# EAGLE design m2_feather_interposer (EAGLE 9.6.2)
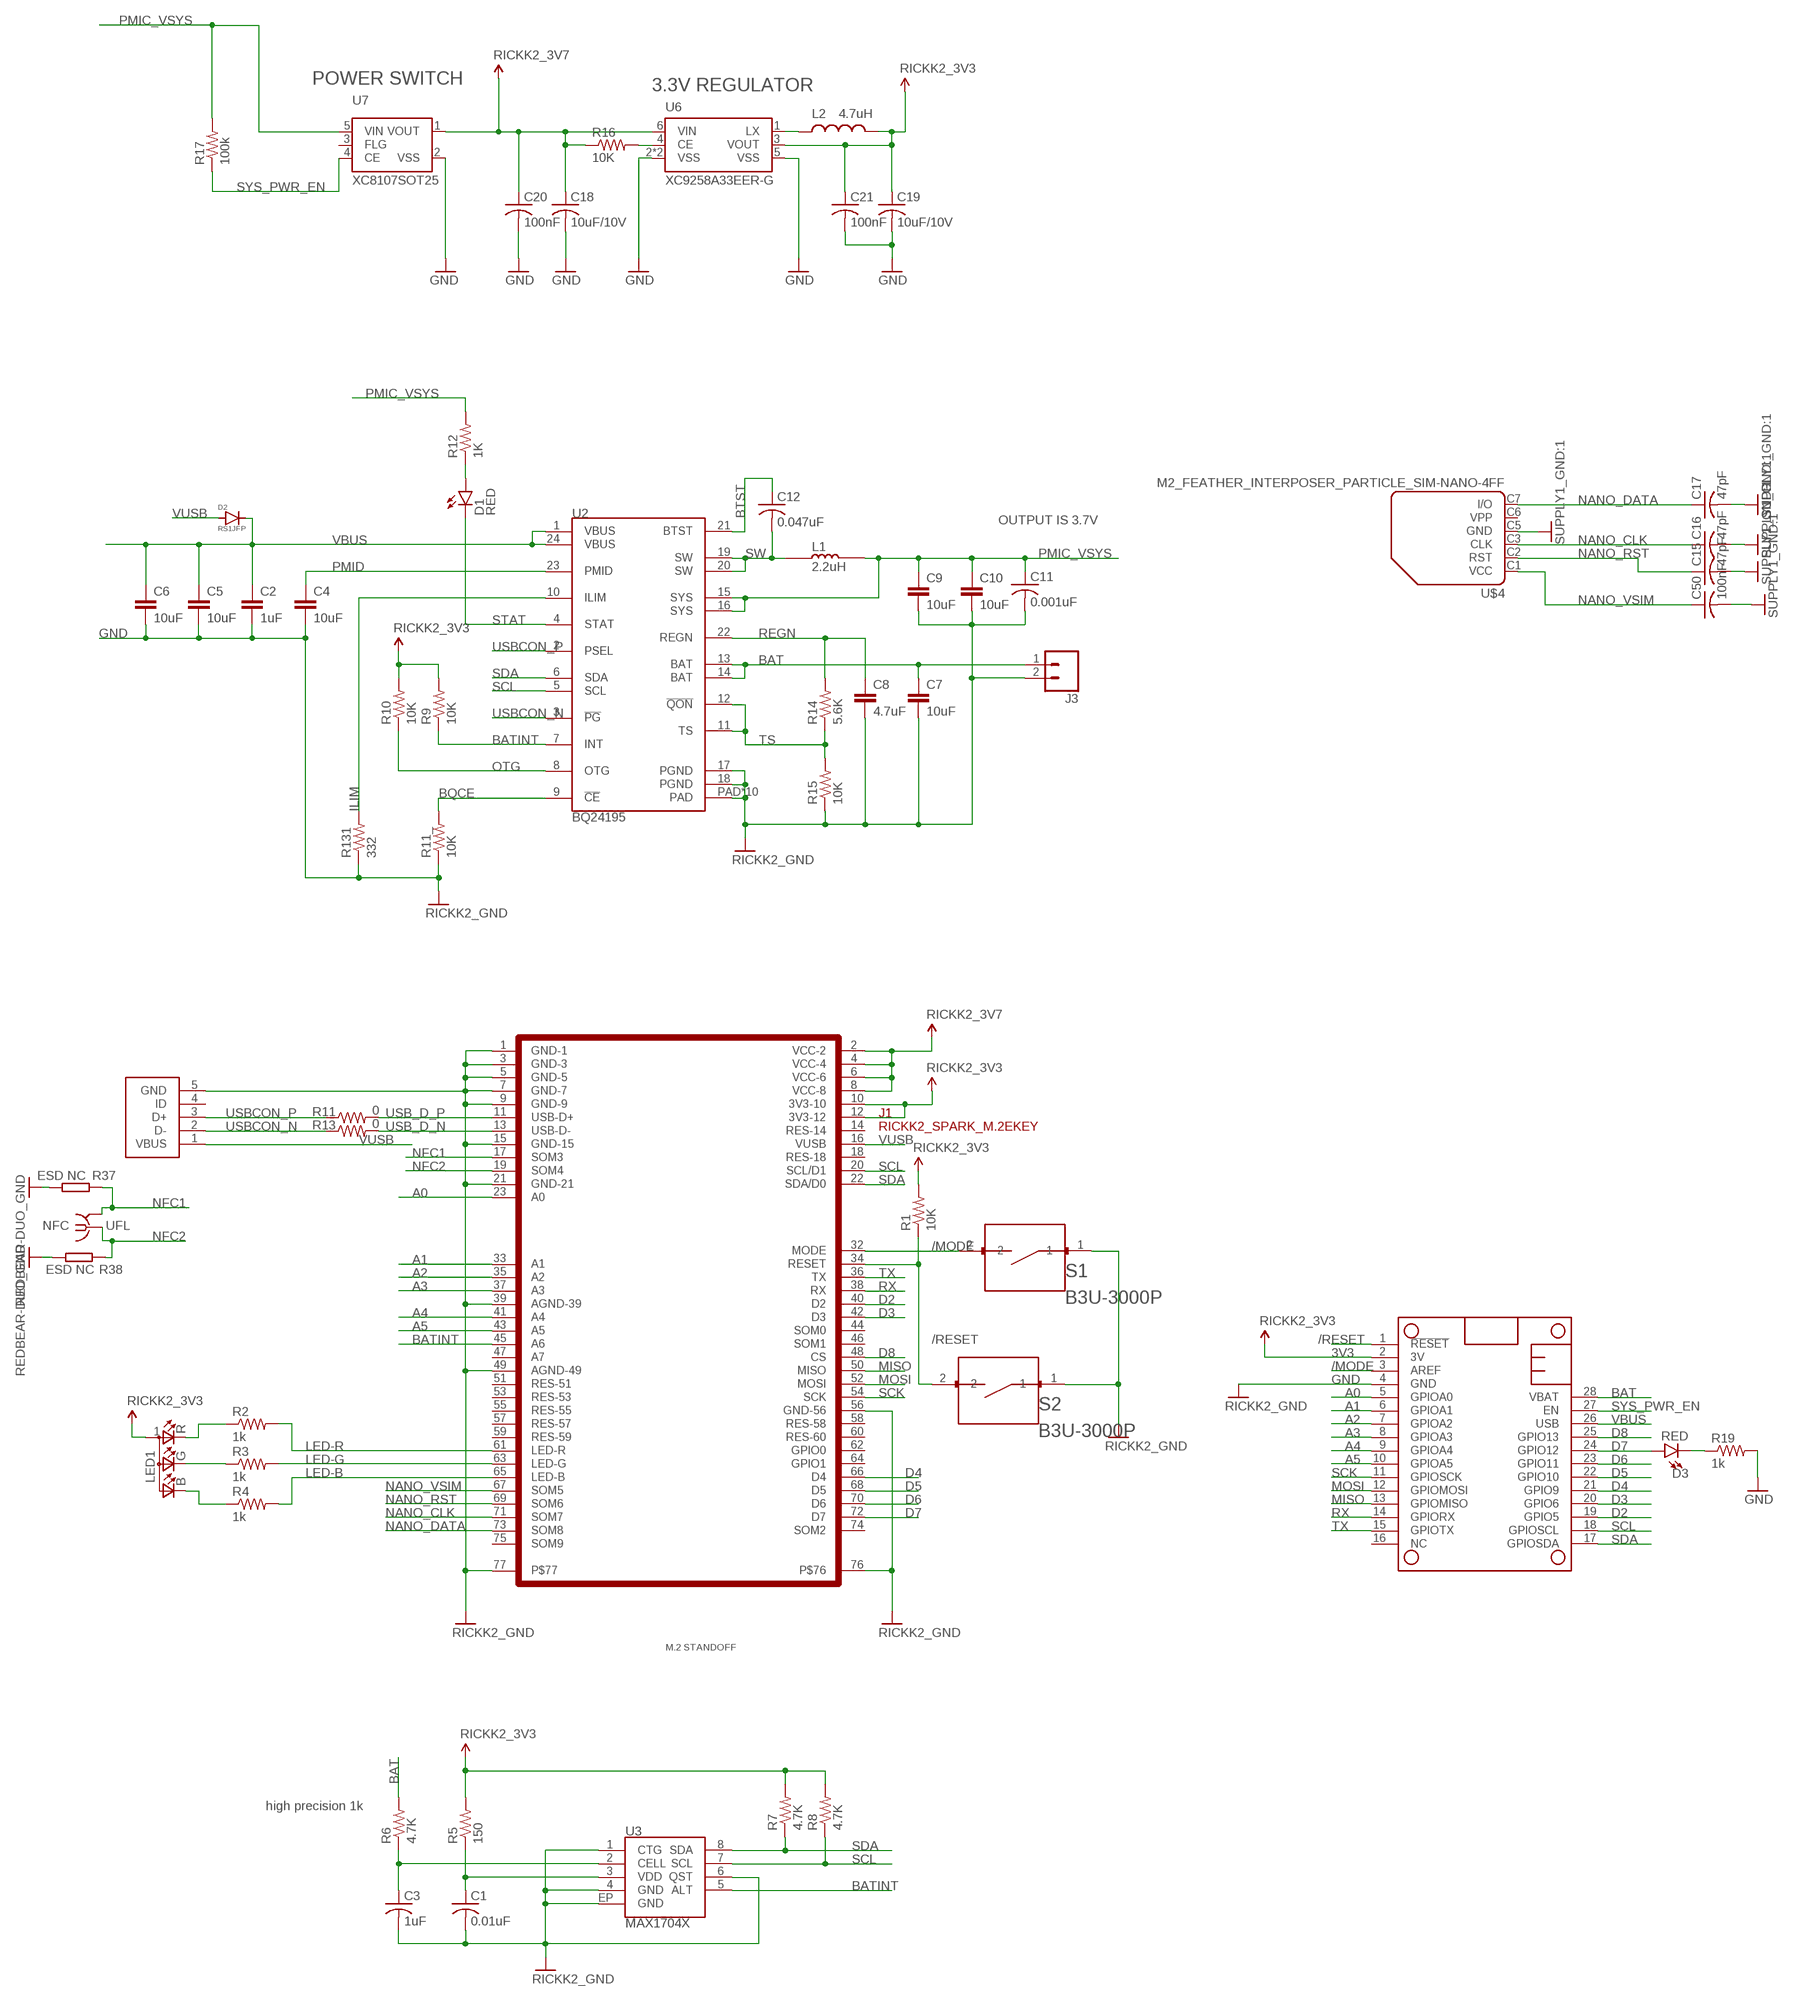
[diagram p0: schematic, sheet 1]

## Parts
C1  0.01uF  C-USC0402  [C0402]
C2  1uF  CAP-1UF-0603.DEV  [0603-CAP]
C3  1uF  C-USC0402  [C0402]
C4  10uF  RICKK2_CAP-10UF-0603  [RICKK2_0603-CAP]
C5  10uF  RICKK2_CAP-10UF-0603  [RICKK2_0603-CAP]
C6  10uF  RICKK2_CAP-10UF-0603  [RICKK2_0603-CAP]
C7  10uF  RICKK2_CAP-10UF-0603  [RICKK2_0603-CAP]
C8  4.7uF  RICKK2_CAP-4.7UF-0603  [RICKK2_0603-CAP]
C9  10uF  RICKK2_CAP-10UF-0603  [RICKK2_0603-CAP]
C10  10uF  RICKK2_CAP-10UF-0603  [RICKK2_0603-CAP]
C11  0.001uF  C-USC0402  [C0402]
C12  0.047uF  C-USC0402  [C0402]
C15  47pF  PARTICLE_C-USC0201_B  [PARTICLE_C0201_B]
C16  47pF  PARTICLE_C-USC0201_B  [PARTICLE_C0201_B]
C17  47pF  PARTICLE_C-USC0201_B  [PARTICLE_C0201_B]
C18  10uF/10V  C-USC0603K  [C0603K]
C19  10uF/10V  C-USC0603K  [C0603K]
C20  100nF  C-USC0603K  [C0603K]
C21  100nF  C-USC0201_B  [C0201_B]
C50  100nF  PARTICLE_C-USC0201_B  [PARTICLE_C0201_B]
D1  RED  RICKK2_LED-RED  [RICKK2_LED-0603]
D2  RS1JFP  RICKK2_DIODE-RS1JFP  [RICKK2_SOD-123HE-ON]
D3  RED  LED-RED0603  [LED-0603]
J1  RICKK2_SPARK_M.2EKEY  [RICKK2_SPARK_M.2EKEY-LESS-CREAM]
J3  CONN_02  [1X02]
L1  2.2uH  RICKK2_INDUCTOR-2.2UH  [RICKK2_1008-BOURNS]
L2  4.7uH  INDUCTOR-SPARKFUNVLS3012ET-4R7M  [INDUCTOR-VLS-E]
LED1  RICKK2_LED-RGB-CREE-SMD  [RICKK2_LED-RGB-CREE-SMD]
MS1  MICROBUILDER_FEATHERWINGSMT_BTM_FEATHER  [SMT_BTM_FEATHERWING]
NFC  UFL  PARTICLE_IPEX-20279-001E  [PARTICLE_IPEX-20279-001E]
R1  10K  R-US_R0402  [R0402]
R2  1k  R-US_R0402  [R0402]
R3  1k  R-US_R0402  [R0402]
R4  1k  R-US_R0402  [R0402]
R5  150  R-US_R0402  [R0402]
R6  4.7K  R-US_R0402  [R0402]
R7  4.7K  R-US_R0402  [R0402]
R8  4.7K  R-US_R0402  [R0402]
R9  10K  R-US_R0402  [R0402]
R10  10K  R-US_R0402  [R0402]
R11  0  R-US_R0402  [R0402]
R11_  10K  R-US_R0402  [R0402]
R12  1K  R-US_R0402  [R0402]
R13  0  R-US_R0402  [R0402]
R14  5.6K  R-US_R0402  [R0402]
R15  10K  R-US_R0402  [R0402]
R16  10K  R-US_R0402  [R0402]
R17  100k  R-US_R0402  [R0402]
R19  1k  R-US_R0402  [R0402]
R37  ESD NC  REDBEAR_RES0402S  [REDBEAR_R-0402S]
R38  ESD NC  REDBEAR_RES0402S  [REDBEAR_R-0402S]
R131  332  R-US_R0402  [R0402]
S1  B3U-3000P  [SW_B3U-3000P]
S2  B3U-3000P  [SW_B3U-3000P]
U2  BQ24195  RICKK2_BQ24195  [RICKK2_24VFQN-TI]
U3  MAX1704X  [TDFN-8]
U6  XC9258A33EER-G  [USP-6C]
U7  XC8107SOT25  [SOT25]
U$1  RICKK2_M2-STANDOFF  [RICKK2_M2-STANDOFF]
U$3  RICKK2_USB-MICRO-B-SOCKET-AMPHENOL  [RICKK2_USB-B-SMT-AMPHENOL]
U$4  M2_FEATHER_INTERPOSER_PARTICLE_SIM-NANO-4FF  [M2_FEATHER_INTERPOSER_PARTICLE_GCT-SIM8100]

## Nets
3V3: C19.1 C21.1 J1.10(3V3-10) J1.12(3V3-12) L2.P$2 LED1.1(A) MS1.2(3V) R1.2 R5.2 R7.2 R8.2 R9.2 R10.2 U6.3(VOUT) ; supply symbol labelled RICKK2_3V3
3V7: C18.1 C20.1 J1.2(VCC-2) J1.4(VCC-4) J1.6(VCC-6) J1.8(VCC-8) R16.1 U6.6(VIN) U7.1(VOUT) ; supply symbol labelled RICKK2_3V7
/MODE: J1.32(MODE) MS1.3(AREF) S1.2
/RESET: J1.34(RESET) MS1.1(!RESET) R1.1 S2.2
A0: J1.23(A0) MS1.5(GPIOA0)
A1: J1.33(A1) MS1.6(GPIOA1)
A2: J1.35(A2) MS1.7(GPIOA2)
A3: J1.37(A3) MS1.8(GPIOA3)
A4: J1.41(A4) MS1.9(GPIOA4)
A5: J1.43(A5) MS1.10(GPIOA5)
BAT: C7.1 J3.1 MS1.28(VBAT) R6.2 U2.13(BAT) U2.14(BAT)
BATINT: J1.45(A6) R9.1 U2.7(INT) U3.5(ALT)
BQCE: R11_.2 U2.9(!CE)
BTST: C12.1 U2.21(BTST)
D2: J1.40(D2) MS1.19(GPIO5)
D3: J1.42(D3) MS1.20(GPIO6)
D4: J1.66(D4) MS1.21(GPIO9)
D5: J1.68(D5) MS1.22(GPIO10)
D6: J1.70(D6) MS1.23(GPIO11)
D7: D3.A J1.72(D7) MS1.24(GPIO12)
D8: J1.48(CS) MS1.25(GPIO13)
GND: C1.2 C2.2 C3.2 C4.2 C5.2 C6.2 C7.2 C8.2 C9.2 C10.2 C11.2 C15.2 C16.2 C17.2 C18.2 C19.2 C20.2 C21.2 C50.2 J1.1(GND-1) J1.3(GND-3) J1.5(GND-5) J1.7(GND-7) J1.9(GND-9) J1.15(GND-15) J1.21(GND-21) J1.39(AGND-39) J1.49(AGND-49) J1.56(GND-56) J1.76 J1.77 J3.2 MS1.4(GND) R11_.1 R15.1 R19.2 R37.2 R38.1 R131.1 S1.1 S2.1 U2.17(PGND) U2.18(PGND) U2.PAD U2.PAD@1(PAD) U2.PAD@2(PAD) U2.PAD@3(PAD) U2.PAD@4(PAD) U2.PAD@5(PAD) U2.PAD@6(PAD) U2.PAD@7(PAD) U2.PAD@8(PAD) U2.PAD@9(PAD) U3.1(CTG) U3.4(GND) U3.6(QST) U3.EP(GND) U6.2(VSS) U6.5(VSS) U6.P$1(VSS) U7.2(VSS) U$3.5(GND) U$4.C5(GND) ; supply symbol labelled RICKK2_GND, REDBEAR-DUO_GND, SUPPLY1_GND:1
ILIM: R131.2 U2.10(ILIM)
LED-B: J1.65(LED-B) R4.2
LED-G: J1.63(LED-G) R3.2
LED-R: J1.61(LED-R) R2.2
MISO: J1.50(MISO) MS1.13(GPIOMISO)
MOSI: J1.52(MOSI) MS1.12(GPIOMOSI)
N$2: LED1.3(G) R3.1
N$3: C3.1 R6.1 U3.2(CELL)
N$5: C1.1 R5.1 U3.3(VDD)
N$6: LED1.4(R) R2.1
N$7: D1.A R12.1
N$10: LED1.2(B) R4.1
N$23: R16.2 U6.4(CE)
N$24: D3.C R19.1
N$25: L2.P$1 U6.1(LX)
NANO_CLK: C16.1 J1.71(SOM7) U$4.C3(CLK)
NANO_DATA: C17.1 J1.73(SOM8) U$4.C7(I/O)
NANO_RST: C15.1 J1.69(SOM6) U$4.C2(RST)
NANO_VSIM: C50.1 J1.67(SOM5) U$4.C1(VCC)
NFC1: J1.17(SOM3) NFC.2@1(GND) NFC.2@2(GND) R37.1
NFC2: J1.19(SOM4) NFC.1 R38.2
OTG: R10.1 U2.8(OTG)
PMIC_VSYS: C9.1 C10.1 C11.1 L1.2 R12.2 R17.2 U2.15(SYS) U2.16(SYS) U7.5(VIN)
PMID: C4.1 U2.23(PMID)
REGN: C8.1 R14.2 U2.22(REGN)
RX: J1.38(RX) MS1.14(GPIORX)
SCK: J1.54(SCK) MS1.11(GPIOSCK)
SCL: J1.20(SCL/D1) MS1.18(GPIOSCL) R8.1 U2.5(SCL) U3.7(SCL)
SDA: J1.22(SDA/D0) MS1.17(GPIOSDA) R7.1 U2.6(SDA) U3.8(SDA)
STAT: D1.C U2.4(STAT)
SW: C12.2 L1.1 U2.19(SW) U2.20(SW)
SYS_PWR_EN: MS1.27(EN) R17.1 U7.4(CE)
TS: R14.1 R15.2 U2.11(TS) U2.12(!QON)
TX: J1.36(TX) MS1.15(GPIOTX)
USB_D_N [diff pair]: J1.13(USB-D-) R13.2
USB_D_P [diff pair]: J1.11(USB-D+) R11.2
USBCON_N [diff pair]: R13.1 U2.3(!PG) U$3.2(D-)
USBCON_P [diff pair]: R11.1 U2.2(PSEL) U$3.3(D+)
VBUS: C2.1 C5.1 C6.1 D2.1(CATHODE) MS1.26(USB) U2.1(VBUS) U2.24(VBUS)
VUSB: D2.2(ANODE) J1.16(VUSB) U$3.1(VBUS)
Unconnected: J1.14(RES-14) J1.18(RES-18) J1.44(SOM0) J1.46(SOM1) J1.47(A7) J1.51(RES-51) J1.53(RES-53) J1.55(RES-55) J1.57(RES-57) J1.58(RES-58) J1.59(RES-59) J1.60(RES-60) J1.62(GPIO0) J1.64(GPIO1) J1.74(SOM2) J1.75(SOM9) MS1.16(NC) U7.3(FLG) U$3.4(ID) U$4.C6(VPP)

## Notes on the sheet
- POWER SWITCH
- 3.3V REGULATOR
- OUTPUT IS 3.7V
- high precision 1k

## Library data of the parts
C1 C3 C11 C12 = adafruit:C-US: CAPACITOR, American symbol
C2 = rickk2:CAP-1UF-0603.DEV: CAP CER 1UF 25V X7R 0603 $ 0.10 Samsung CL10B105KA8NNNC https://www.digikey.com/product-detail/en/samsung-electro-mechanics-america-inc/CL10B105KA8NNNC/1276-1184-1-ND/3889270 1µF ±10% 25V Ceramic Capacitor X7R 0603 (1608 Metric)
C4-C7 C9 C10 = m2_feather_interposer:RICKK2_CAP-10UF-0603: CAP CER 10UF 16V X5R 0805 $ 0.21 https://www.digikey.com/product-detail/en/murata-electronics-north-america/GRM21BR61C106KE15L/490-3886-1-ND/965928
C8 = m2_feather_interposer:RICKK2_CAP-4.7UF-0603: Murata X5R series CAP CER 4.7UF 6.3V X5R 0603 $0.12 https://www.digikey.com/product-detail/en/murata-electronics-north-america/GRM188R60J475KE19J/490-6407-1-ND/3845604
C15-C17 C50 = m2_feather_interposer:PARTICLE_C-US: Capacitor
C18-C20 = rcl:C-US: CAPACITOR, American symbol; SPICEPREFIX: C
C21 = Particle:C-US: Capacitor
D1 = m2_feather_interposer:RICKK2_LED-RED: LED RED CLEAR 0603 SMD $0.41 Red 631nm LED Indication - Discrete 2V 0603 (1608 Metric) 5mA@2V https://www.digikey.com/product-detail/en/lite-on-inc/LTST-C193KRKT-5A/160-1830-1-ND/2356251 Res = 270 ohm @ 3.3V Res = 680 ohm 1/8W @ 5V Res = 2.2K 1/8W @ 12V
D2 = m2_feather_interposer:RICKK2_DIODE-RS1JFP: Reverse voltage protection diode - not ordered yet! ON Semiconductor RS1JFP $0.44 DIODE GP 600V 1.2A SOD123HE Diode Standard 600V 1.2A Surface Mount SOD-123HE https://www.digikey.com/product-detail/en/on-semiconductor/RS1JFP/RS1JFPCT-ND/5722970 Used in Ford open power supply 1=Cathode=Large Pad=side with band 2=Anode=Small Pad
D3 = SparkFun-LED:LED-RED: Red SMD LED Used in manufacturing of most products at SparkFun Packages: 0603 - SMD 0603 package [Product Link] <http://docs.avagotech.com/docs/AV02-0551EN> 0603 SMART - SMD 0603 SMART package ( more efficient and expensive)[Product Link] <http://www.osram-os.com/Graphics/XPic2/00077099_0.pdf> 1206 - SMD1206 package [Product Link] <https://www.sparkfun.com/datasheets/DevTools/LilyPad/Q150OVS4.pdff> SparkFun Products: Pro Mini 328 -5V <https://www.sparkfun.com/products/821> RedBoard <https://www.sparkfun.com/products/12757> IOIO-OTG <https://www.sparkfun.com/products/13613>; PROD_ID: DIO-00819
J1 = m2_feather_interposer:RICKK2_SPARK_M.2EKEY: $1.42 CONN FEMALE 67POS 0.020 GOLD TE Connectivity AMP Connectors 2199230-4 https://www.digikey.com/product-detail/en/te-connectivity-amp-connectors/2199230-4/A115904CT-ND/4208916
J3 = SparkFun-Connectors:CONN_02: Multi connection point. Often used as Generic Header-pin footprint for 0.1 inch spaced/style header connections On any of the 0.1 inch spaced packages, you can populate with these: Break Away Headers - Straight <https://www.sparkfun.com/products/116> (PRT-00116) Break Away Male Headers - Right Angle <https://www.sparkfun.com/products/553> (PRT-00553) Female Headers <https://www.sparkfun.com/products/115> (PRT-00115) Break Away Headers - Machine Pin <https://www.sparkfun.com/products/117> (PRT-00117) Break Away Female Headers - Swiss Machine Pin <https://www.sparkfun.com/products/743> (PRT-00743) For SCREWTERMINALS and SPRING TERMINALS visit here: Screw Terimnals on SparkFun.com <https://www.sparkfun.com/search/results?term=Screw+Terminals> (5mm/3.5mm/2.54mm spacing) This device is also useful as a general connection point to wire up your design to another part of your project. Our various solder wires solder well into these plated through hole pads. Hook-Up Wire - Assortment (Stranded, 22 AWG) <https://www.sparkfun.com/products/11375> (PRT-11375) Hook-Up Wire - Assortment (Solid Core, 22 AWG) <https://www.sparkfun.com/products/11367> (PRT-11367) View the entire wire category on our website here <https://www.sparkfun.com/categories/141> Special notes: Molex polarized connector foot print use with: PRT-08233 with associated crimp pins and housings. 2.54_SCREWTERM for use with PRT-10571. 3.5mm Screw Terminal footprints for PRT-08084 5mm Screw Terminal footprints for use with PRT-08432
L1 = m2_feather_interposer:RICKK2_INDUCTOR-2.2UH: 2.2uH inductor $0.31 **not ordered yet** Bourns Inc. SRN2512-2R2M FIXED IND 2.2UH 2.3A 102 MOHM 2.2µH Semi-Shielded Wirewound Inductor 2.3A 102 mOhm Max 1008 (2520 Metric) https://www.digikey.com/product-detail/en/bourns-inc/SRN2512-2R2M/SRN2512-2R2MCT-ND/4867759
L2 = Particle:INDUCTOR-SPARKFUN: Inductors Basic Inductor/Choke - 0603 and 1206. Footprints are not proven and vary greatly between part numbers. SRN6045- 33uH, 20% 1.4A
LED1 = m2_feather_interposer:RICKK2_LED-RGB-CREE-SMD: LED RGB DIFFUSED 4SMD $ 0.35 Cree CLMVB-FKA-CFHEHLCBB7A363 2mm 4-PLCC common anode RGB LED https://www.digikey.com/product-detail/en/cree-inc/CLMVB-FKA-CFHEHLCBB7A363/CLMVB-FKA-CFHEHLCBB7A363CT-ND/6138627 Red=68 ohm, Green/Blue=33 ohm @ 3.3V
MS1 = m2_feather_interposer:MICROBUILDER_FEATHERWING
NFC = m2_feather_interposer:PARTICLE_IPEX-20279-001E: Ultra Miniature Coaxial SMT RF Receptacle
R1-R11 R11_ R12-R17 R19 R131 = adafruit:R-US_: RESISTOR, American symbol
R37 R38 = m2_feather_interposer:REDBEAR_RES: RES
S1 S2 = m2_feather_interposer:B3U-3000P: Ultra-small Surface-mounting Tactile Switches with High Contact Reliability Check prices <https://pricing.snapeda.com/parts/B3U-3100P-B/Omron/view-part?ref=eda>; AVAILABILITY: Warning; DESCRIPTION: Tactile Switch SPST-NO Side Actuated Surface Mount, Right Angle; MF: Omron; MP: B3U-3100P-B; PACKAGE: Custom Package Omron; PRICE: None; PURCHASE-URL: https://pricing.snapeda.com/search/part/B3U-3100P-B/?ref=eda
U2 = m2_feather_interposer:RICKK2_BQ24195: Texas Instruments BQ24195LRGER $2.93 IC CHRG MGMT LI-ION/POL 24VQFN Charger IC Lithium-Ion/Polymer 24-VQFN (4x4) https://www.digikey.com/product-detail/en/texas-instruments/BQ24195LRGER/296-49149-1-ND/9351369
U3 = SparkFun-IC-Power:MAX1704X: MAX17043/MAX17044: Battery Fuel Guage (43 is 1cell, 44 is 2cell); PROD-ID: IC-10399
U6 = Particle:XC9258: 1.0A Synchronous Step-Down DC/DC Converters
U7 = Particle:XC8107
U$1 = m2_feather_interposer:RICKK2_M2-STANDOFF: https://www.digikey.com/product-detail/en/jae-electronics/SM3ZS067U310-NUT1-R1800/670-2864-1-ND/5955848
U$3 = m2_feather_interposer:RICKK2_USB-MICRO-B-SOCKET-AMPHENOL: CONN USB MICRO B RECPT SMT R/A $0.42 Amphenol FCI 10118194-0001LF https://www.digikey.com/products/en?keywords=609-4618-1-nd
U$4 = m2_feather_interposer:M2_FEATHER_INTERPOSER_PARTICLE_SIM-NANO-4FF: SIM NANO 4FF

## Net classes
0 default: width 0.152 mm, clearance 0.152 mm
1 diff pair: width 0.152 mm

## Board
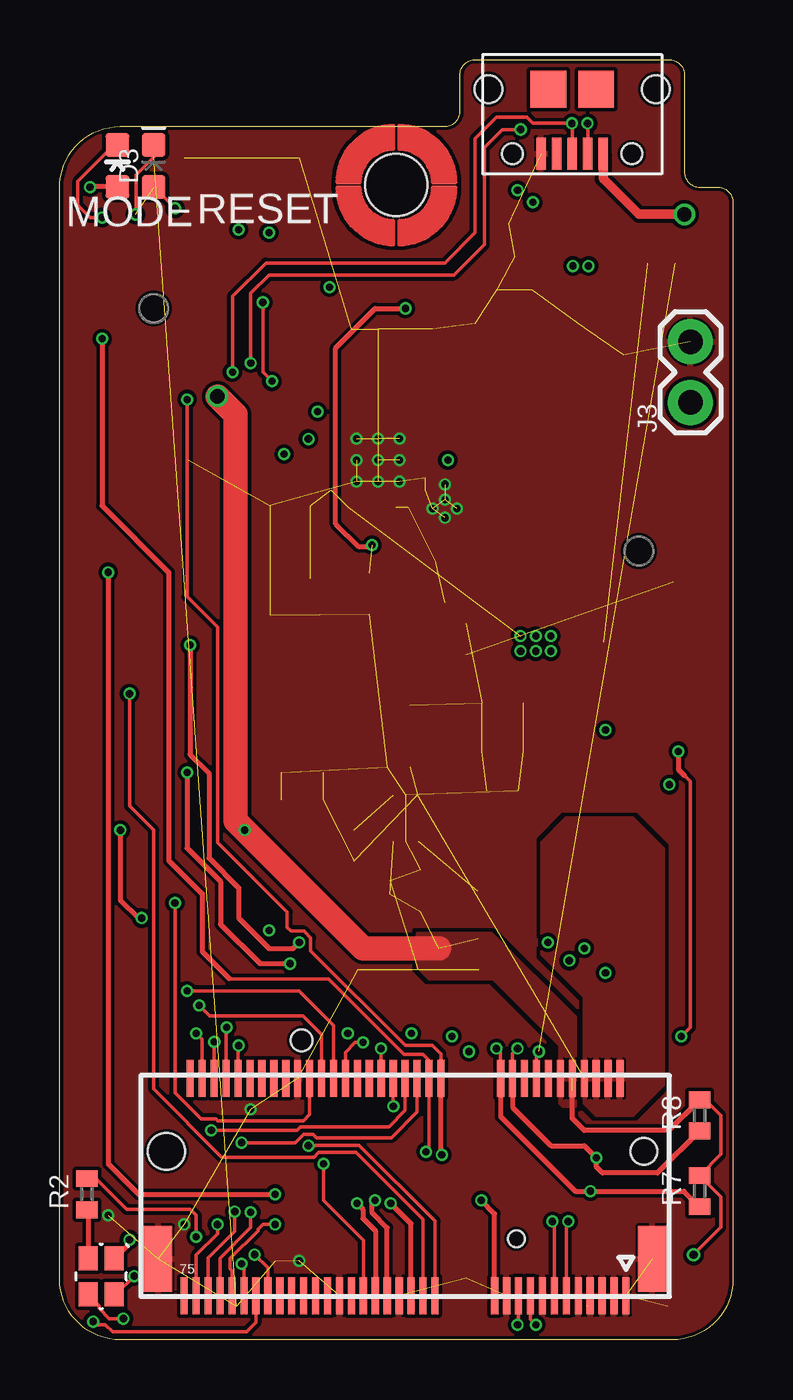
[diagram p1: board, top side]
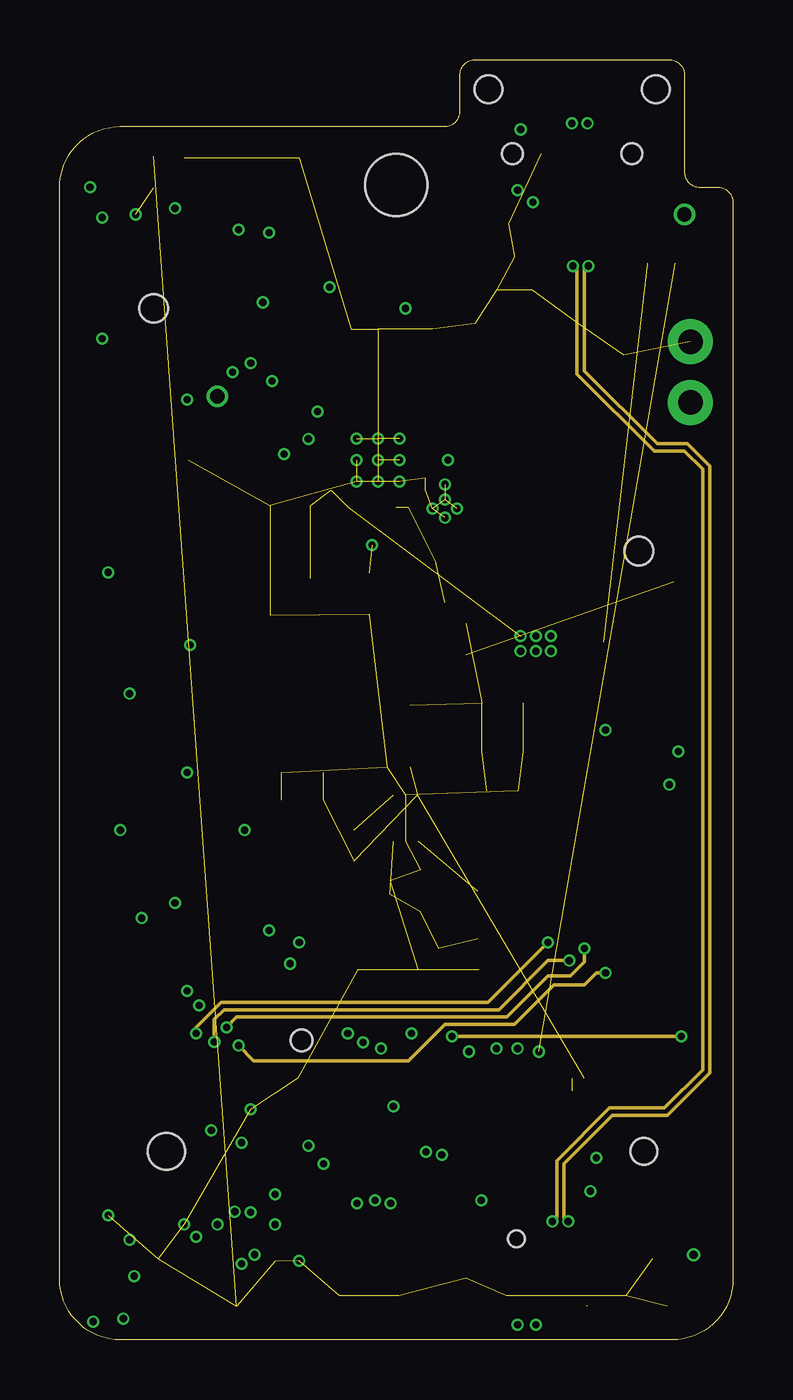
[diagram p2: board, inner layer Route2]
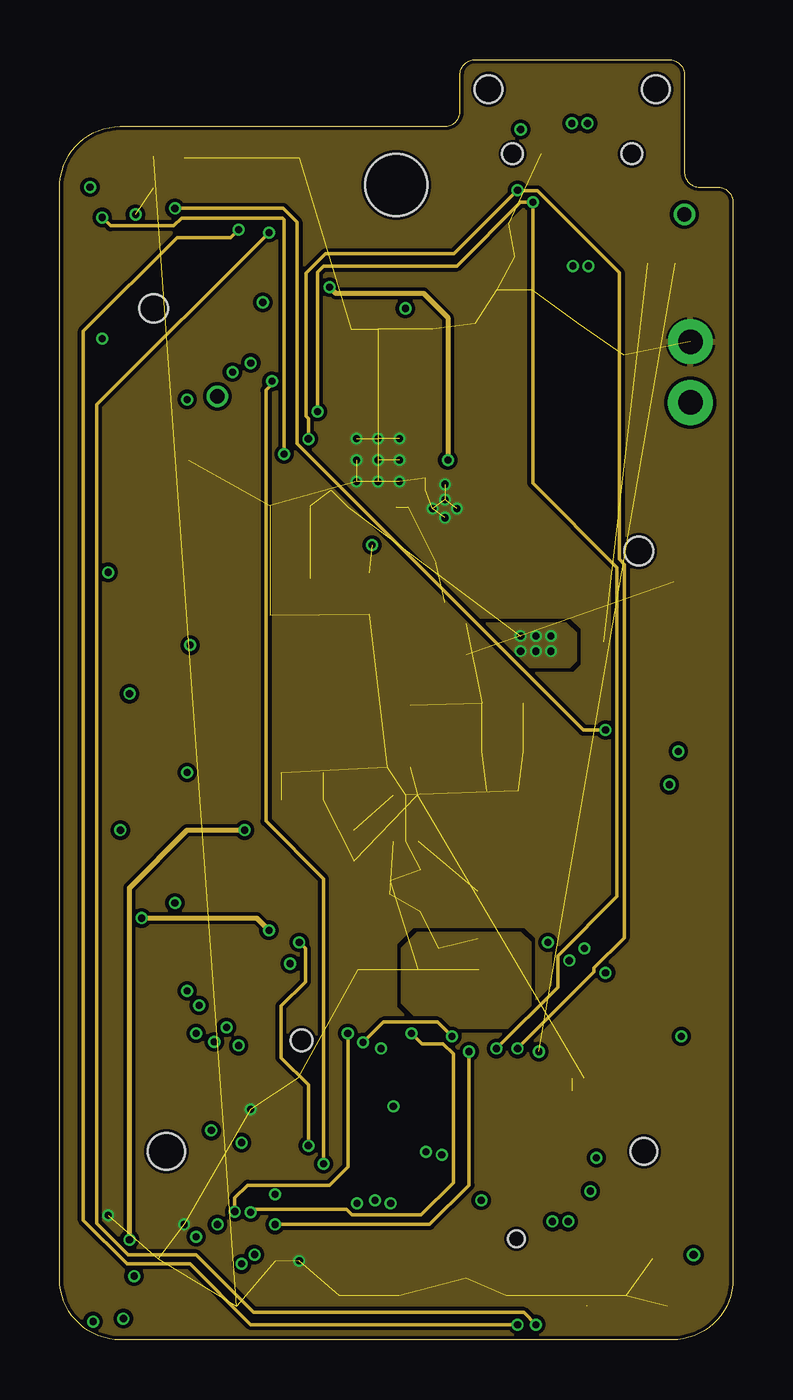
[diagram p3: board, inner layer Route15]
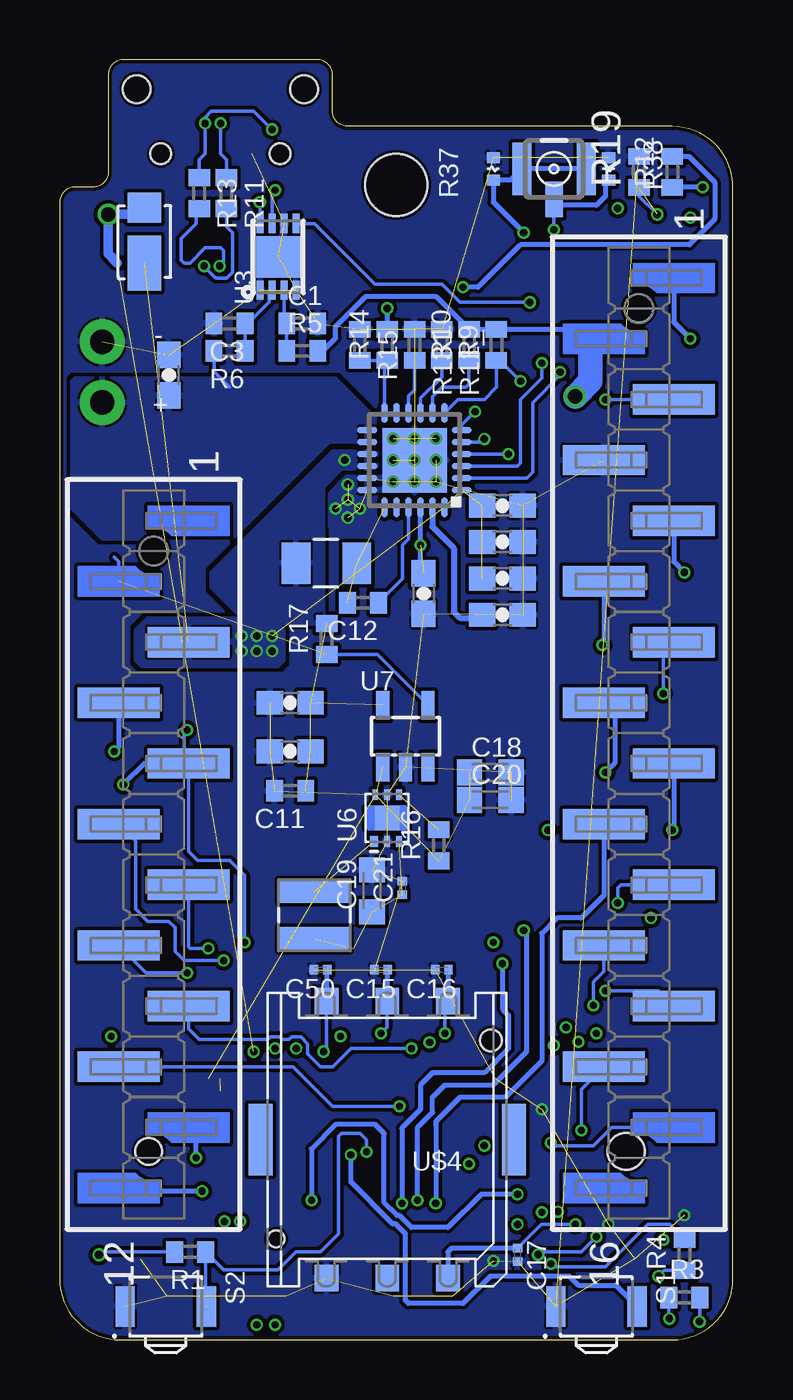
[diagram p4: board, bottom side, seen from below]

Size 28.19 x 53.59 mm. Coordinates in mm from the lower left corner, seen from the top.
Outline: 25.65,0 2.54,0 arc-90 0,2.54 0,48.26 arc-90 2.54,50.8 16.13,50.8 arc90 16.76,51.44 16.76,52.96 arc-90 17.4,53.59 25.53,53.59 arc-90 26.16,52.96 26.16,48.9 arc90 26.8,48.26 27.56,48.26 arc-90 28.19,47.62 28.19,2.54 arc-90 25.65,0
Copper layers (1+2*15+16): Top 0.035mm / dielectric 0.11mm / Route2 0.0175mm / dielectric 0.4mm / Route15 0.0175mm / dielectric 0.11mm / Bottom 0.035mm
Design rules "particle-4layer *": minimum track width 6mil, minimum drill 0.3mm, track to track 6mil, track to pad 6mil, pad to pad 6mil, via to via 6mil, smd to smd 0mil, copper to edge 6mil, drill to drill 6mil, minimum pad ring 4mil, minimum via ring 4mil, stop-mask expansion 0.01mm, vias tented up to drill 16mil, thermal gap 4mil

### Footprints (pad centres in the part's own frame; a part is rotated, then mirrored left to right if it is on the bottom)
C0402 = smd 0.7 x 0.9: 1 -0.65,0; 2 0.65,0
0603-CAP = smd 1.1 x 1: 1 -0.85,0; 2 0.85,0
RICKK2_0603-CAP = smd 1.1 x 1: 1 -0.85,0; 2 0.85,0
PARTICLE_C0201_B = smd 0.356 x 0.406: 1 -0.279,0; 2 0.279,0
C0603K = smd 1.05 x 1.08: 1 -0.875,0; 2 0.875,0
C0201_B = smd 0.356 x 0.406: 1 -0.279,0; 2 0.279,0
RICKK2_LED-0603 = smd 1 x 1: A 0,-0.877; C 0,0.877
RICKK2_SOD-123HE-ON = smd 2.3 x 1.4: 1 -0.9,0 | smd 1.25 x 1.4: 2 1.425,0
LED-0603 = smd 1 x 1: A -0.877,0; C 0.877,0
RICKK2_SPARK_M.2EKEY-LESS-CREAM = smd 0.3 x 1.55: 1 -9.62,4.51; 2 -9.37,-4.59; 3 -9.12,4.51; 4 -8.87,-4.59; 5 -8.62,4.51; 6 -8.37,-4.59; 7 -8.12,4.51; 8 -7.87,-4.59; 9 -7.62,4.51; 10 -7.37,-4.59; 11 -7.12,4.51; 12 -6.87,-4.59; 13 -6.62,4.51; 14 -6.37,-4.59; 15 -6.12,4.51; 16 -5.87,-4.59; 17 -5.62,4.51; 18 -5.37,-4.59; 19 -5.12,4.51; 20 -4.87,-4.59; 21 -4.62,4.51; 22 -4.37,-4.59; 23 -4.12,4.51; 32 -1.87,-4.59; 33 -1.62,4.51; 34 -1.37,-4.59; 35 -1.12,4.51; 36 -0.87,-4.59; 37 -0.62,4.51; 38 -0.37,-4.59; 39 -0.12,4.51; 40 0.13,-4.59; 41 0.38,4.51; 42 0.63,-4.59; 43 0.88,4.51; 44 1.13,-4.59; 45 1.38,4.51; 46 1.63,-4.59; 47 1.88,4.51; 48 2.13,-4.59; 49 2.38,4.51; 50 2.63,-4.59; 51 2.88,4.51; 52 3.13,-4.59; 53 3.38,4.51; 54 3.63,-4.59; 55 3.88,4.51; 56 4.13,-4.59; 57 4.38,4.51; 58 4.63,-4.59; 59 4.88,4.51; 60 5.13,-4.59; 61 5.38,4.51; 62 5.63,-4.59; 63 5.88,4.51; 64 6.13,-4.59; 65 6.38,4.51; 66 6.63,-4.59; 67 6.88,4.51; 68 7.13,-4.59; 69 7.38,4.51; 70 7.63,-4.59; 71 7.88,4.51; 72 8.13,-4.59; 73 8.38,4.51; 74 8.63,-4.59; 75 8.88,4.51 | smd 1.2 x 2.75: 76 9.98,2.96; 77 -10.72,2.96 | hole 1.1: -10.37,-1.54 | hole 1.55: 9.63,-1.54
1X02 = drill 1.016 pad 1.88: 1 0,0; 2 2.54,0
RICKK2_1008-BOURNS = smd 1.2 x 1.75: 1 0,0; 2 2.55,0
INDUCTOR-VLS-E = smd 1 x 3: P$1 -1,0; P$2 1,0
RICKK2_LED-RGB-CREE-SMD = smd 1 x 0.8: 1 1.5,0; 2 0,0; 3 0,1.1; 4 1.5,1.1
SMT_BTM_FEATHERWING = smd 0.01 x 0.01 bottom: 1 6.35,-0.19; 2 8.89,2.73; 15 41.91,-0.19; 16 44.45,2.73; 17 44.45,23.05; 18 41.91,20.13; 27 19.05,23.05; 28 16.51,20.13 | smd 1.27 x 3.43 bottom: 3 11.43,-0.19; 4 13.97,2.73; 5 16.51,-0.19; 6 19.05,2.73; 7 21.59,-0.19; 8 24.13,2.73; 9 26.67,-0.19; 10 29.21,2.73; 11 31.75,-0.19; 12 34.29,2.73; 13 36.83,-0.19; 14 39.37,2.73; 19 39.37,23.05; 20 36.83,20.13; 21 34.29,23.05; 22 31.75,20.13; 23 29.21,23.05; 24 26.67,20.13; 25 24.13,23.05; 26 21.59,20.13 | hole 1.19: 17.78,21.59; 7.62,1.27
PARTICLE_IPEX-20279-001E = smd 0.73 x 1.5: 1 0,1.28 | smd 0.8 x 2.2: 2@1 -1.35,0; 2@2 1.35,0
R0402 = smd 0.7 x 0.9: 1 -0.65,0; 2 0.65,0
REDBEAR_R-0402S = smd 0.45 x 0.55: 1 -0.47,0; 2 0.47,0
SW_B3U-3000P = smd 0.8 x 1.7: 1 1.7,0; 2 -1.7,0
RICKK2_24VFQN-TI = smd 0.85 x 0.28: 1 -1.975,1.25; 2 -1.975,0.75; 3 -1.975,0.25; 4 -1.975,-0.25; 5 -1.975,-0.75; 6 -1.975,-1.25; 13 1.975,-1.25; 14 1.975,-0.75; 15 1.975,-0.25; 16 1.975,0.25; 17 1.975,0.75; 18 1.975,1.25 | smd 0.28 x 0.85: 7 -1.25,-1.975; 8 -0.75,-1.975; 9 -0.25,-1.975; 10 0.25,-1.975; 11 0.75,-1.975; 12 1.25,-1.975; 19 1.25,1.975; 20 0.75,1.975; 21 0.25,1.975; 22 -0.25,1.975; 23 -0.75,1.975; 24 -1.25,1.975 | smd 2.7 x 2.7: PAD 0,0 | drill 0.3 pad 0.406: PAD@1 -0.9,0.9; PAD@2 0,0.9; PAD@3 0.9,0.9; PAD@4 -0.9,0; PAD@5 0,0; PAD@6 0.9,0; PAD@7 -0.9,-0.9; PAD@8 0,-0.9; PAD@9 0.9,-0.9
TDFN-8 = smd 0.8 x 0.3: 1 -1.4,0.75; 2 -1.4,0.25; 3 -1.4,-0.25; 4 -1.4,-0.75; 5 1.4,-0.75; 6 1.4,-0.25; 7 1.4,0.25; 8 1.4,0.75 | smd 1.73 x 1.88: EP 0,0
USP-6C = smd 0.45 x 0.35: 1 -0.975,0.55 | smd 0.45 x 0.25: 2 -0.975,0; 3 -0.975,-0.5; 4 0.975,-0.5; 5 0.975,0; 6 0.975,0.5 | smd 1.016 x 1.016: P$1 0,0
SOT25 = smd 0.55 x 1.2: 1 -0.95,-1.3; 2 0,-1.3; 3 0.95,-1.3; 4 0.95,1.3; 5 -0.95,1.3
RICKK2_M2-STANDOFF = hole 2.6: 0,0
RICKK2_USB-B-SMT-AMPHENOL = smd 0.4 x 1.35: 1 -1.3,0; 2 -0.65,0; 3 0,0; 4 0.65,0; 5 1.3,0 | smd 1.5 x 1.55: P$6 -1,-2.7; P$7 1,-2.7 | hole 0.85: -2.5,0; 2.5,0 | hole 1.15: -3.5,-2.7; 3.5,-2.7
M2_FEATHER_INTERPOSER_PARTICLE_GCT-SIM8100 = smd 1 x 1.1: C1 2.54,-5.8; C2 0,-5.8; C3 -2.54,-5.8; C5 2.54,5.8; C6 0,5.8; C7 -2.54,5.8 | smd 1 x 3: NC@1 -5.3,0; NC@2 5.3,0 | hole 0.7: 4.65,4.15 | hole 0.9: -4.35,-4.15

### Placement (x,y rotation side)
C1  18.03,42.55 0 bottom
C2  9.65,33.4 0 bottom
C3  21.08,42.55 180 bottom
C4  9.65,30.35 0 bottom
C5  9.65,31.88 0 bottom
C6  9.65,34.93 0 bottom
C7  23.62,40.39 90 bottom
C8  12.95,31.24 270 bottom
C9  18.54,24.64 180 bottom
C10  18.54,26.67 180 bottom
C11  18.54,22.99 180 bottom
C12  15.49,30.86 180 bottom
C15  14.73,15.49 180 bottom
C16  12.19,15.49 180 bottom
C17  9.02,3.56 270 bottom
C18  10.16,23.75 0 bottom
C19  15.11,18.8 90 bottom
C20  10.16,22.61 0 bottom
C21  13.84,18.92 90 bottom
C50  17.27,15.49 180 bottom
D1  2.41,49.15 0 top
D2  24.64,45.97 90 bottom
D3  3.94,49.15 90 top
J1  14.1,6.35 180 top
J3  26.42,39.24 90 top
L1  15.75,32.51 180 bottom
L2  17.53,17.78 270 bottom
LED1  2.29,1.91 90 top
MS1  2.67,50.8 270 top
NFC  7.49,49.02 180 bottom
R1  22.73,3.68 180 bottom
R2  1.14,6.1 90 top
R3  2.03,1.78 0 bottom
R4  2.03,3.56 90 bottom
R5  18.03,41.4 0 bottom
R6  21.08,41.4 180 bottom
R7  26.8,6.22 90 top
R8  26.8,9.4 90 top
R9  9.91,41.66 90 bottom
R10  11.05,41.66 90 bottom
R11  21.21,48.01 270 bottom
R11_  12.19,41.66 270 bottom
R12  2.54,48.9 90 bottom
R13  22.35,48.01 270 bottom
R14  14.48,41.66 90 bottom
R15  15.62,41.66 270 bottom
R16  12.32,20.7 90 bottom
R17  17.02,29.34 90 bottom
R19  3.94,48.9 90 bottom
R37  10.03,49.02 90 bottom
R38  5.21,49.02 270 bottom
R131  13.34,41.66 270 bottom
S1  5.71,1.4 180 bottom
S2  23.75,1.4 180 bottom
U2  13.34,36.83 180 bottom
U3  19.05,45.34 90 bottom
U6  14.48,21.84 90 bottom
U7  13.72,25.27 0 bottom
U$1  14.1,48.35 0 top
U$3  21.46,49.66 180 top
U$4  14.48,8.38 180 bottom

### Tracks (layer width: path | path; a pad name or v marks a point on that pad's centre or on a via)
3V3  (via drill 0.3, 0.35, 0.6)  (5 unrouted)
  Top 0.152: v26.54,3.56 27.69,4.7 27.69,5.98 R7.2 27.69,7.76 27.69,9.4 27.04,10.05 R8.2
  Top 0.203: R8.2 25.51,8.76 21.97,8.76 21.46,9.27 21.46,10.41 | LED1.1 2.92,4.04 v2.92,4.19
  Top 1.016: v6.6,39.5 7.37,38.73 7.37,21.72 v7.75,21.34 12.7,16.38 15.88,16.38
  Route15 0.203: v2.92,4.19 2.92,18.92 5.33,21.34 v7.75,21.34 7.75,21.21
  Bottom 0.152: R1.2 26.42,3.68 v26.54,3.56
  Bottom 0.203: R5.2 17.18,41.4 16.64,41.94 16.64,42.42 15.37,43.69 12.45,43.69 11.06,42.31 R10.2 R9.2 5.79,42.31 MS1.2
  Bottom 0.406: MS1.2 5.97,41.34
  Bottom 1.016: 5.97,41.34 5.97,40.13 v6.6,39.5
  pour Top: 21.59,9.78 21.59,13.51 18.08,17.02 14.99,17.02 14.99,15.62 15.49,15.11 18.16,15.11 20.95,12.32 20.95,9.91 21.08,9.78
  pour Route15: 19.56,13.08 15.37,13.08 14.35,14.1 14.35,16.38 14.99,17.02 19.3,17.02 19.68,16.64 19.68,13.21
3V7  (5 unrouted)
  pour Top: 21.97,9.91 21.97,12.31 21.97,14.35 20.19,16.13 20.19,20.83 21.21,21.84 24,21.84 25.27,20.57 25.27,14.99 25.27,10.67 24,9.4 22.48,9.4
/MODE  (via drill 0.3)
  Top 0.152: v5.33,39.37 5.33,31.11 6.6,29.85 6.6,20.83 9.53,17.91 9.53,17.27 9.68,17.12 10.23,17.12 10.51,16.84 10.51,16.28 14.48,12.32 15.62,12.32 15.97,11.97 J1.32
  Top 0.203: v16,7.75 15.97,7.78 J1.32
  Bottom 0.152: MS1.3 v5.33,39.37
  Bottom 0.203: v16,7.75 16,6.6 14.25,4.85 14.12,4.85 13.72,4.45 13.72,1.65 13.59,1.52 11.3,1.52 10.16,2.67 6.86,2.67 6.48,2.29 4.9,2.29 S1.2
/RESET  (via drill 0.3)  (1 unrouted)
  Top 0.152: v15.35,7.87 15.47,8 J1.34 15.47,11.69 15.21,11.94 14.42,11.94 11.25,15.11 7.11,15.11
  Top 0.203: v1.78,41.91 1.78,34.93 4.57,32.13 4.57,20.07 5.97,18.67 5.97,16.26 7.11,15.11
  Bottom 0.152: 22.08,1.43 R1.1 21.32,2.92 19.05,2.92 18.29,3.68 17.27,3.68 16.51,4.45 16.51,8.51 16.38,8.64 15.62,8.64 15.35,8.36 v15.35,7.87
  Bottom 0.203: MS1.1 2.48,42.61 v1.78,41.91
A0  (via drill 0.3)
  Top 0.203: v2.03,32.13 2.03,7.37 3.3,6.1 v9.02,6.1 | J1.23 18.22,5.28 v17.65,5.84
  Bottom 0.203: MS1.5 2.48,32.58 v2.03,32.13 | v9.02,6.1 10.54,6.1 11.94,4.7 13.46,4.7 13.97,5.21 14.07,5.21 14.61,5.74 14.61,8.64 14.99,9.02 16.64,9.02 17.65,8 v17.65,5.84
A1  (via drill 0.3)
  Top 0.152: v10.41,8.13 10.7,8.13 10.72,8.15 12.54,8.15 15.72,4.97 J1.33
  Top 0.203: v5.46,29.08 5.46,24.51 6.25,23.72 6.25,20.17 7.49,18.93 7.49,17.65 8.76,16.38 9.78,16.38 v10.03,16.64
  Route15 0.152: v10.41,8.13 10.41,10.67 9.27,11.81 9.27,13.97 10.29,14.99 10.29,16.38 v10.03,16.64
  Bottom 0.203: MS1.6 5.4,29.15 v5.46,29.08
A2  (via drill 0.3)
  Top 0.152: v2.92,27.05 2.92,22.35 3.94,21.34 3.94,10.5 6.79,7.65 10.65,7.65 10.85,7.85 12.41,7.85 15.22,5.04 J1.35
  Bottom 0.152: 2.92,28.77 v2.92,27.05
  Bottom 0.203: MS1.7 2.92,28.77
A3  (via drill 0.3)
  Top 0.203: v5.33,23.75 5.33,20.58 6.73,19.19 6.73,17.4 8.38,15.75 v9.65,15.75 | J1.37 14.72,4.86 v13.86,5.72
  Bottom 0.203: MS1.8 4.95,26.23 4.95,24.13 v5.33,23.75 | v9.65,15.75 9.65,13.84 9.4,13.59 9.4,12.19 10.41,11.18 12.57,11.18 13.08,10.67 13.08,9.65 13.86,8.87 v13.86,5.72
A4  (via drill 0.3)
  Top 0.203: J1.41 13.72,4.7 13.08,5.33 13.08,5.72 v13.21,5.84 | v2.54,21.34 2.54,18.41 3.3,17.65 v3.43,17.65
  Route15 0.203: v3.43,17.65 8.25,17.65 v8.76,17.14
  Bottom 0.203: MS1.9 2.48,21.53 2.54,21.46 v2.54,21.34 | v8.76,17.14 8.64,17.02 8.64,12.07 10.03,10.67 12.06,10.67 12.57,10.16 12.57,9.52 13.21,8.89 v13.21,5.84
A5  (via drill 0.3)
  Top 0.203: J1.43 13.22,4.56 12.7,5.08 12.7,5.46 v12.45,5.72
  Bottom 0.203: MS1.10 5.4,18.61 6.35,17.65 7.37,17.65 8,17.02 8,11.68 9.53,10.16 11.43,10.16 12.45,9.14 12.45,9.07 12.45,9.02 v12.45,5.72
BAT
  Bottom 0.152: R6.2 21.73,40.53 21.08,39.88
  pour Bottom: 27.56,40.26 16.64,40.26 14.99,38.61 14.99,37.59 16.89,37.59 20.95,33.53 26.42,33.53 27.69,34.8 27.69,40.13
BATINT  (via drill 0.3)
  Top 0.152: J1.45 12.72,4.17 11.05,5.84 v11.05,7.37 | v8.51,43.43 8.51,40.51 v8.89,40.13
  Route15 0.152: v11.05,7.37 11.05,19.3 8.64,21.72 8.64,39.75 8.89,40.01 v8.89,40.13
  Bottom 0.152: v8.89,40.13 9.76,41.01 R9.1 9.91,39.88 10.41,39.37 11.52,39.37 U2.7 | U3.5 17.53,46.74 14.99,44.2 12.19,44.2 11.43,43.43 v8.51,43.43
BQCE
  Bottom 0.152: R11_.2 12.19,40.31 13.08,39.42 U2.9
BTST
  Bottom 0.152: U2.21 13.59,33.53 13.84,33.27 13.84,31.86 C12.1
D2  (via drill 0.3)
  Top 0.152: J1.40 v13.97,9.78
  Bottom 0.152: v13.97,9.78 16.76,9.78 18.41,11.43 MS1.19
D3  (via drill 0.3)
  Top 0.152: J1.42 v13.46,12.19
  Bottom 0.152: v13.46,12.19 16,12.19 16.76,11.43 17.27,11.43 17.81,11.97 17.81,12.39 18.09,12.67 18.49,12.67 18.59,12.57 18.88,12.57 18.98,12.67 19.38,12.67 19.47,12.57 22.35,12.57 22.8,13.02 MS1.20
D4  (via drill 0.3)
  Top 0.152: J1.66 7.47,12.29 v7.49,12.32
  Route2 0.152: v22.86,15.37 22.48,15.37 21.97,14.86 20.7,14.86 19.05,13.21 16.13,13.21 14.61,11.68 8.13,11.68 v7.49,12.32
  Bottom 0.152: MS1.21 24.57,15.37 v22.86,15.37
D5  (via drill 0.3)
  Top 0.152: J1.68 6.97,13.06 v6.98,13.08
  Route2 0.152: v21.97,16.38 21.97,15.83 21.38,15.24 20.45,15.24 18.72,13.51 7.42,13.51 v6.98,13.08
  Bottom 0.152: MS1.22 22.8,16.45 22.73,16.38 v21.97,16.38
D6  (via drill 0.3)
  Top 0.152: J1.70 v6.47,12.46 v6.48,12.47
  Route2 0.152: v21.34,15.88 20.45,15.88 18.39,13.82 6.88,13.82 6.48,13.41 v6.48,12.47
  Bottom 0.152: MS1.23 25.02,20.89 25.02,18.03 24.51,17.53 23.62,17.53 23.37,17.27 23.37,16.26 22.99,15.88 v21.34,15.88
D7  (via drill 0.3)
  Top 0.152: J1.72 5.97,12.32 5.97,12.57 v5.71,12.83 | D3.A v4.83,47.38 v4.83,47.37
  Route2 0.152: v5.71,12.83 5.71,13.08 6.76,14.12 17.93,14.12 v20.45,16.64
  Route15 0.152: v4.83,47.37 9.37,47.37 9.93,46.8 9.93,37.52 21.93,25.53 v22.86,25.53
  Bottom 0.152: v22.86,25.53 22.99,25.4 22.99,24.13 | MS1.24 22.8,20.45 22.42,20.07 21.08,20.07 20.45,19.43 v20.45,16.64
  Bottom 0.203: MS1.24 22.99,24.13 24.64,24.13 v25.53,23.24
D8  (via drill 0.3)
  Top 0.152: J1.48 11.97,12.04 12.38,12.45 v12.7,12.45 | 26.16,23.62 26.42,23.37 26.42,13.08 v26.04,12.7
  Top 0.203: v25.91,24.64 25.91,23.88 26.16,23.62
  Route2 0.152: v26.04,12.7 v16.43,12.7
  Route15 0.152: v16.43,12.7 15.82,13.31 13.56,13.31 v12.7,12.45
  Bottom 0.203: MS1.25 25.72,24.83 v25.91,24.64
GND  (via drill 0.3)  (70 unrouted)
  other vias: 16.13,35.81 16.13,35.18 16.13,34.42 15.62,34.8 16.64,34.8 10.03,3.3 8,9.65 5.21,4.83 2.03,5.21
  pour Top (rank 3): -1.14,-1.9 -1.14,53.98 33.15,53.98 33.15,-1.9
  pour Bottom (rank 3): -1.14,-1.65 -1.14,54.1 34.93,54.1 34.93,-1.65
  pour Route15 (rank 3): -1.52,-2.29 -1.52,56.52 30.73,56.52 30.73,-2.29
  pour Bottom: 14.86,36.07 16.26,36.07 16.89,35.43 16.89,34.04 16.64,33.78 15.75,33.78 14.86,34.67
ILIM
  Bottom 0.152: U2.10 13.59,39.5 13.34,39.75 R131.2
LED-B  (via drill 0.3)
  Top 0.152: v7.62,3.17 7.72,3.08 J1.65
  Bottom 0.152: R4.2 2.65,4.83 3.56,4.83 5.33,3.05 7.49,3.05 v7.62,3.17
LED-G  (via drill 0.3)
  Top 0.152: J1.63 8.22,0.72 7.82,0.33 2.21,0.33 1.9,0.64 1.52,0.64 v1.4,0.76
  Bottom 0.152: v1.4,0.76 1.38,0.78 R3.2
LED-R  (via drill 0.3)
  Top 0.152: R2.2 1.52,6.75 2.81,5.46 5.46,5.46 5.71,5.21 v5.71,4.32 | v8.16,3.57 8.72,3 J1.61
  Bottom 0.152: v5.71,4.32 6.35,3.68 8.04,3.68 v8.16,3.57
MISO  (via drill 0.3)
  Top 0.152: v5.33,14.61 10.03,14.61 11.47,13.17 J1.50
  Bottom 0.152: v5.33,14.61 3.11,14.61 MS1.13
MOSI  (via drill 0.3)
  Top 0.152: J1.52 10.97,12.78 10.19,13.56 6.28,13.56 v5.84,14
  Bottom 0.152: v5.84,14 5.84,14.99 5.4,15.43 MS1.12
N$2  (via drill 0.3)
  Top 0.152: LED1.3 1.66,1.43 1.66,1.31 2.08,0.89 v2.67,0.89
  Bottom 0.152: R3.1 2.68,0.9 v2.67,0.89
N$3
  Bottom 0.152: U3.2 19.42,43.82 19.42,43.44 20.32,42.55 C3.1 R6.1
N$5
  Bottom 0.152: U3.3 18.8,42.66 C1.1 R5.1
N$6
  Top 0.203: R2.1 1.19,5.4 LED1.4
N$7  (via drill 0.3)
  Top 0.203: D1.A 1.28,48.27 v1.27,48.26
  Bottom 0.203: v1.27,48.26 2.52,48.26 R12.1
N$10  (via drill 0.3)
  Top 0.152: v3.11,2.67 2.35,1.91 LED1.2
  Bottom 0.152: R4.1 2.87,2.91 v3.11,2.67
N$23  (1 unrouted)
N$24  (via drill 0.3)  (1 unrouted)
  Top 0.152: D3.C 3.94,49.51 3.21,48.78 3.21,47.15 v3.18,47.12
  Bottom 0.152: v3.18,47.12 3.94,47.88
N$25  (1 unrouted)
NANO_CLK  (via drill 0.3)
  Top 0.152: v7.33,5.37 7.33,4.54 6.22,3.42 J1.71
  Route15 0.152: v7.33,5.37 7.33,5.94 7.87,6.48 11.3,6.48 12.06,7.24 v12.06,12.83
  Bottom 0.152: v12.06,12.83 12.06,14.1 11.94,14.22
  Bottom 0.203: C16.1 11.94,15.47 11.94,14.22 U$4.C3
NANO_DATA  (via drill 0.3)
  Top 0.152: J1.73 5.72,3.56 6.6,4.45 v6.6,4.83
  Bottom 0.152: v6.6,4.83 8.03,4.83 C17.1
  Bottom 0.203: C17.1 11.79,3.83 11.94,3.68 U$4.C7
NANO_RST  (via drill 0.3)
  Top 0.152: v8,5.33 8,4.7 6.72,3.42 J1.69
  Route15 0.152: v8,5.33 8.13,5.46 12.02,5.46 12.25,5.24 15.14,5.24 16.48,6.58 16.48,11.97 16.05,12.39 15.16,12.39 v14.73,12.83
  Bottom 0.152: U$4.C2 14.48,13.08 v14.73,12.83
  Bottom 0.203: C15.1 14.48,15.47 U$4.C2
NANO_VSIM  (via drill 0.3)
  Top 0.152: J1.67 7.22,2.9 7.14,2.98 7.14,3.41 8.31,4.57 8.31,4.62 8.51,4.83 v9.02,4.83
  Route15 0.152: v17.14,12.07 17.14,6.48 15.49,4.83 v9.02,4.83
  Bottom 0.152: v17.14,12.07 17.02,12.19 U$4.C1
  Bottom 0.203: C50.1 17.02,15.47 U$4.C1
NFC1  (via drill 0.3)
  Top 0.152: J1.17 19.72,0.86 v19.94,0.64
  Route15 0.152: v19.94,0.64 19.43,1.14 8.13,1.14 5.71,3.56 2.88,3.56 1.55,4.88 1.55,39.14 v8.76,46.36
  Bottom 0.203: NFC.2@1 NFC.2@2 9.31,48.55 R37.1 10.03,47.62 v8.76,46.36
NFC2  (via drill 0.3)
  Top 0.152: J1.19 19.22,0.68 v19.18,0.64
  Route15 0.152: v19.18,0.64 8,0.64 5.46,3.17 2.83,3.17 0.99,5.01 0.99,42.23 4.91,46.15 7.16,46.15 v7.49,46.48
  Bottom 0.152: v7.49,46.48 7.49,47.62 7.55,47.68
  Bottom 0.203: R38.2 5.33,48.43 5.33,47.88 5.71,47.5 7.25,47.5 NFC.1 7.55,47.68
OTG
  Bottom 0.152: R10.1 11.05,40.01 11.18,39.88 12.19,39.88 12.57,39.5 12.57,38.82 U2.8
PMIC_VSYS  (via drill 0.3)  (4 unrouted)
  Route15 0.203: v11.3,44.07 11.56,43.82 15.24,43.82 16.26,42.8 v16.26,36.83
  Bottom 0.203: v11.3,44.07 10.67,44.07 8.89,45.85 1.82,45.85 0.76,46.91 0.76,48.47 1.84,49.55 R12.2
  pour Bottom: 14.86,37.21 16.76,37.21 21.84,32.13 21.84,31.5 20.32,29.97 17.4,29.97 17.14,30.23 17.14,35.69 16.38,36.45 14.99,36.45 14.86,36.58
PMID
  Bottom 0.254: U2.23 12.58,34.05 11.68,33.15 11.68,30.48 11.43,30.23 10.63,30.23
  Bottom 0.406: 10.63,30.23 C4.1
REGN  (via drill 0.3)  (1 unrouted)
  Top 0.203: v14.48,43.18 13.21,43.18 11.56,41.53 11.56,34.16 12.51,33.21 13.02,33.21 v13.08,33.27
  Bottom 0.203: C8.1 13.08,32.22 U2.22 | v14.48,43.18 R14.2
RX  (via drill 0.3)
  Top 0.152: v6.35,8.76 9.94,8.76 10.09,8.91 13.78,8.91 14.47,9.6 J1.38
  Bottom 0.152: MS1.14 6.35,10.48 v6.35,8.76
SCK  (via drill 0.3)
  Top 0.152: v4.83,18.29 4.83,10.33 5.92,9.24 6.55,9.24 6.62,9.17 10.21,9.17 10.47,9.43 J1.54
  Bottom 0.152: v4.83,18.29 4.83,18.92 4.7,19.05 MS1.11
SCL  (via drill 0.3)
  Top 0.152: J1.20 18.97,11.98 v19.18,12.19
  Top 0.203: J1.20 18.97,9.73 20.57,8.13 21.97,8.13 v22.48,7.62 22.48,7.24 22.73,6.99 25.03,6.99 R8.1
  Route15 0.152: v10.41,37.72 10.41,38.56 10.31,38.66 10.31,44.66 11.13,45.47 16.51,45.47 v19.18,48.13 19.2,48.11 20.01,48.11 23.43,44.68 23.43,32.68 23.64,32.47 23.64,16.83 22.38,15.57 22.38,15.39 v19.18,12.19
  Bottom 0.152: U3.7 19.3,48.01 v19.18,48.13 | U2.5 10.55,37.58 v10.41,37.72
  Bottom 0.203: v22.48,7.62 22.48,8.57 MS1.18
SDA  (via drill 0.3)
  Top 0.152: J1.22 18.47,12.01 v18.29,12.19
  Top 0.203: J1.22 18.47,9.35 21.59,6.22 v22.22,6.22 26.15,6.22 R7.1
  Route15 0.152: v10.79,38.86 10.79,44.7 11.05,44.96 16.64,44.96 19.3,47.62 v19.81,47.62 19.81,35.87 23.34,32.34 23.34,18.56 20.86,16.07 20.86,14.76 v18.29,12.19
  Bottom 0.152: U2.6 11.36,38.3 v10.79,38.86 | U3.8 19.8,47.61 v19.81,47.62
  Bottom 0.203: v22.22,6.22 25.59,6.22 MS1.17
STAT  (via drill 0.3)
  Top 0.152: v1.78,46.99 1.27,46.99 0.76,47.5 0.76,48.51 2.27,50.03 D1.C
  Route15 0.152: v1.78,46.99 2.13,46.64 4.77,46.64 5.1,46.96 9.34,46.96 9.4,46.91 v9.4,37.08
  Bottom 0.152: U2.4 v9.4,37.08
SW  (3 unrouted)
SYS_PWR_EN  (1 unrouted)
  Bottom 0.152: MS1.27 25.72,32.58 25.91,32.77 | R17.1 14.88,28.69 U7.4
TS
  Bottom 0.152: U2.11 U2.12 14.59,40.9 R14.1 R15.2
TX  (via drill 0.3)
  Top 0.152: v7.62,8.25 9.86,8.25 10.21,8.61 10.61,8.61 10.76,8.46 13.89,8.46 14.97,9.54 J1.36
  Bottom 0.152: v7.62,8.25 7.49,8.13 5.84,8.13 5.08,8.89 MS1.15
USB_D_N  (via drill 0.3)
  Top 0.152: v20.64,4.95 20.72,4.88 J1.13
  Route2 0.152: v20.64,4.95 20.82,5.13 20.82,7.49 23.02,9.7 25.32,9.7 26.92,11.3 26.92,36.45 26.16,37.21 24.89,37.21 21.67,40.44 21.67,44.83 21.54,44.96 v21.49,44.96
  Bottom 0.152: R13.2 22.48,47.23 22.48,46.74 23.11,46.1 23.11,45.21 22.99,45.09 22.73,45.09 22.1,45.72 21.46,45.72 21.34,45.59 21.34,45.11 v21.49,44.96
USB_D_P  (via drill 0.3)
  Top 0.152: v21.29,4.95 21.22,4.88 J1.11
  Route2 0.152: v21.29,4.95 21.12,5.13 21.12,7.37 23.15,9.4 25.45,9.4 27.14,11.09 | 27.14,11.09 | 27.14,11.09 27.23,11.18 27.23,36.58 27.14,36.67 | 27.14,36.67 | 27.14,36.67 26.29,37.52 25.02,37.52 21.97,40.56 21.97,44.83 22.1,44.96 v22.15,44.96
  Bottom 0.152: R11.2 21.21,46.61 20.95,46.36 20.95,44.7 21.21,44.45 21.64,44.45 21.67,44.48 21.69,44.48 21.97,44.76 21.97,44.78 v22.15,44.96
USBCON_N  (via drill 0.3)
  Top 0.152: U$3.2 v22.11,50.92 v22.11,50.93 | v8,40.89 8,43.82 8.76,44.58 16.51,44.58 17.78,45.85 17.78,49.91 18.54,50.67 v19.3,50.67
  Bottom 0.152: R13.1 22.35,49.41 U$3.2 v22.11,50.93 22.11,51.17 21.84,51.44 20.07,51.44 v19.3,50.67 | U2.3 9.02,36.58 8.89,36.7 8.89,39.37 8,40.26 v8,40.89
USBCON_P  (via drill 0.3)
  Top 0.152: U$3.3 v21.46,50.92 v21.45,50.93 19.81,50.93 19.56,51.18 18.29,51.18 17.4,50.29 17.4,46.36 16.13,45.09 8.64,45.09 7.24,43.69 v7.24,40.51
  Bottom 0.152: R11.1 21.21,49.41 21.45,49.66 v21.45,50.93 | U2.2 10.04,36.08 8.62,36.08 8.38,36.32 8.38,39.24 7.24,40.39 v7.24,40.51
VBUS  (via drill 0.3)  (6 unrouted)
  other vias: 20.57,28.83 20.57,29.46 19.94,29.46 19.94,28.83 19.3,29.46 19.3,28.83
  pour Bottom: 21.59,30.23 24.51,30.23 25.02,29.72 25.02,28.45 24.77,28.19 19.05,28.19 18.8,28.45 18.8,28.7 18.8,29.72 19.3,30.23
  pour Route15: 21.21,29.97 12.95,29.97 11.94,30.99 11.94,34.04 12.32,34.42 12.32,35.31 11.81,35.81 8.76,35.81 8.38,35.43 8.38,34.54 8.64,34.29 9.27,34.29 9.27,30.61 11.68,28.19 21.34,28.19 21.59,28.45 21.59,29.59
VUSB  (via drill 0.3, 0.6)  (1 unrouted)
  Top 0.152: J1.16 19.97,11.97 v20.07,12.07
  Top 0.406: U$3.1 22.76,48.61 24.26,47.12 v26.16,47.12
  Bottom 0.406: D2.2 24.92,47.12 v26.16,47.12 26.16,45.47 25.78,45.09

### Text on the board
tPlace: RESET | MODE | VBUS
bNames: - | +